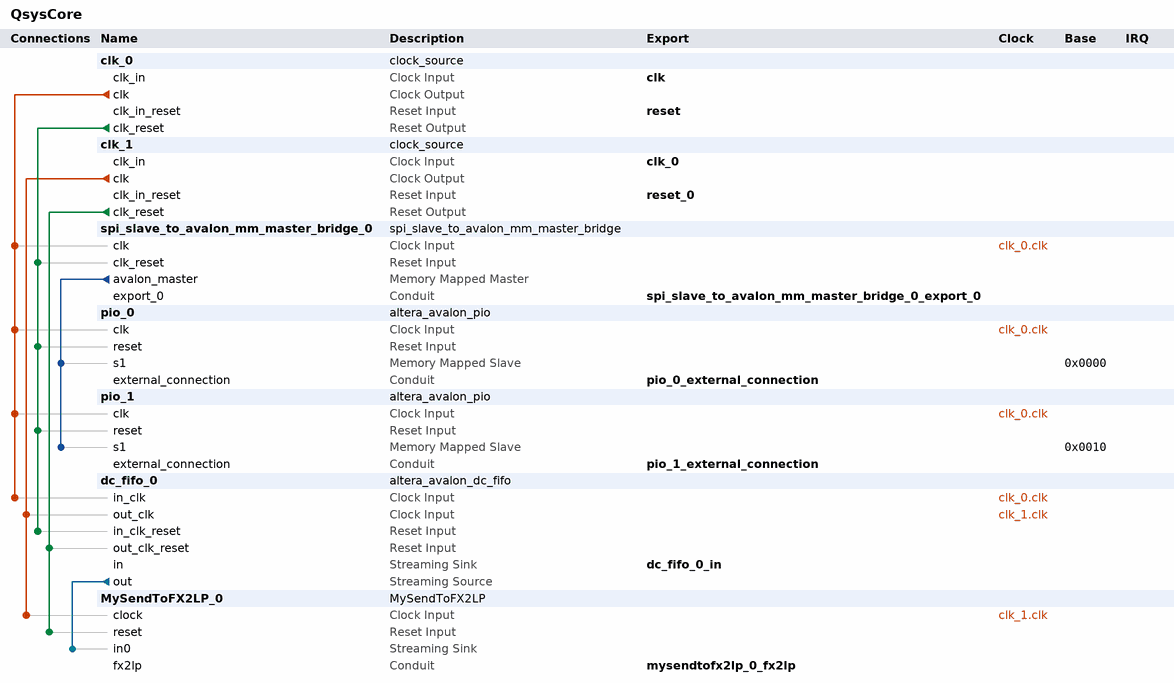
[diagram p0: system contents]
# Platform Designer (Qsys) system QsysCore, Cyclone II EP2C5T144C8
# Parameters at their usual value, and those the tool derives, are not listed.
package require -exact qsys 13.0
create_system QsysCore
set_project_property DEVICE_FAMILY {Cyclone II}
set_project_property DEVICE EP2C5T144C8

add_instance clk_0 clock_source 13.0
set_instance_parameter_value clk_0 clockFrequency 64000000

add_instance clk_1 clock_source 13.0
set_instance_parameter_value clk_1 clockFrequency 32000000

add_instance spi_slave_to_avalon_mm_master_bridge_0 spi_slave_to_avalon_mm_master_bridge 13.0
set_instance_parameter_value spi_slave_to_avalon_mm_master_bridge_0 SYNC_DEPTH 2

add_instance pio_0 altera_avalon_pio 13.0.1.99.2
set_instance_parameter_value pio_0 direction Output
set_instance_parameter_value pio_0 width 32

add_instance pio_1 altera_avalon_pio 13.0.1.99.2
set_instance_parameter_value pio_1 direction Output
set_instance_parameter_value pio_1 width 32

add_instance dc_fifo_0 altera_avalon_dc_fifo 13.0
set_instance_parameter_value dc_fifo_0 BITS_PER_SYMBOL 32
set_instance_parameter_value dc_fifo_0 FIFO_DEPTH 1024
set_instance_parameter_value dc_fifo_0 USE_PACKETS 0
set_instance_parameter_value dc_fifo_0 WR_SYNC_DEPTH 2
set_instance_parameter_value dc_fifo_0 RD_SYNC_DEPTH 2

add_instance MySendToFX2LP_0 MySendToFX2LP 1.0

# connections
add_connection clk_0.clk dc_fifo_0.in_clk clock
add_connection clk_0.clk pio_0.clk clock
add_connection clk_0.clk pio_1.clk clock
add_connection clk_0.clk spi_slave_to_avalon_mm_master_bridge_0.clk clock
add_connection clk_1.clk dc_fifo_0.out_clk clock
add_connection clk_1.clk MySendToFX2LP_0.clock clock
add_connection clk_0.clk_reset dc_fifo_0.in_clk_reset reset
add_connection clk_0.clk_reset pio_0.reset reset
add_connection clk_0.clk_reset pio_1.reset reset
add_connection clk_0.clk_reset spi_slave_to_avalon_mm_master_bridge_0.clk_reset reset
add_connection clk_1.clk_reset dc_fifo_0.out_clk_reset reset
add_connection clk_1.clk_reset MySendToFX2LP_0.reset reset
add_connection spi_slave_to_avalon_mm_master_bridge_0.avalon_master pio_0.s1 avalon
set_connection_parameter_value spi_slave_to_avalon_mm_master_bridge_0.avalon_master/pio_0.s1 baseAddress 0x0000
add_connection spi_slave_to_avalon_mm_master_bridge_0.avalon_master pio_1.s1 avalon
set_connection_parameter_value spi_slave_to_avalon_mm_master_bridge_0.avalon_master/pio_1.s1 baseAddress 0x0010
add_connection dc_fifo_0.out MySendToFX2LP_0.in0 avalon_streaming

# exported interfaces
add_interface clk clock sink
set_interface_property clk EXPORT_OF clk_0.clk_in
add_interface reset reset sink
set_interface_property reset EXPORT_OF clk_0.clk_in_reset
add_interface spi_slave_to_avalon_mm_master_bridge_0_export_0 conduit end
set_interface_property spi_slave_to_avalon_mm_master_bridge_0_export_0 EXPORT_OF spi_slave_to_avalon_mm_master_bridge_0.export_0
add_interface pio_0_external_connection conduit end
set_interface_property pio_0_external_connection EXPORT_OF pio_0.external_connection
add_interface pio_1_external_connection conduit end
set_interface_property pio_1_external_connection EXPORT_OF pio_1.external_connection
add_interface clk_0 clock sink
set_interface_property clk_0 EXPORT_OF clk_1.clk_in
add_interface reset_0 reset sink
set_interface_property reset_0 EXPORT_OF clk_1.clk_in_reset
add_interface dc_fifo_0_in avalon_streaming sink
set_interface_property dc_fifo_0_in EXPORT_OF dc_fifo_0.in
add_interface mysendtofx2lp_0_fx2lp conduit end
set_interface_property mysendtofx2lp_0_fx2lp EXPORT_OF MySendToFX2LP_0.fx2lp

set_interconnect_requirement {$system} qsys_mm.clockCrossingAdapter HANDSHAKE
set_interconnect_requirement {$system} qsys_mm.maxAdditionalLatency 1

save_system QsysCore.qsys
